# EAGLE schematic GPS_radiologger_LG77_CMWX_MAX v6 (EAGLE 9.7.0)
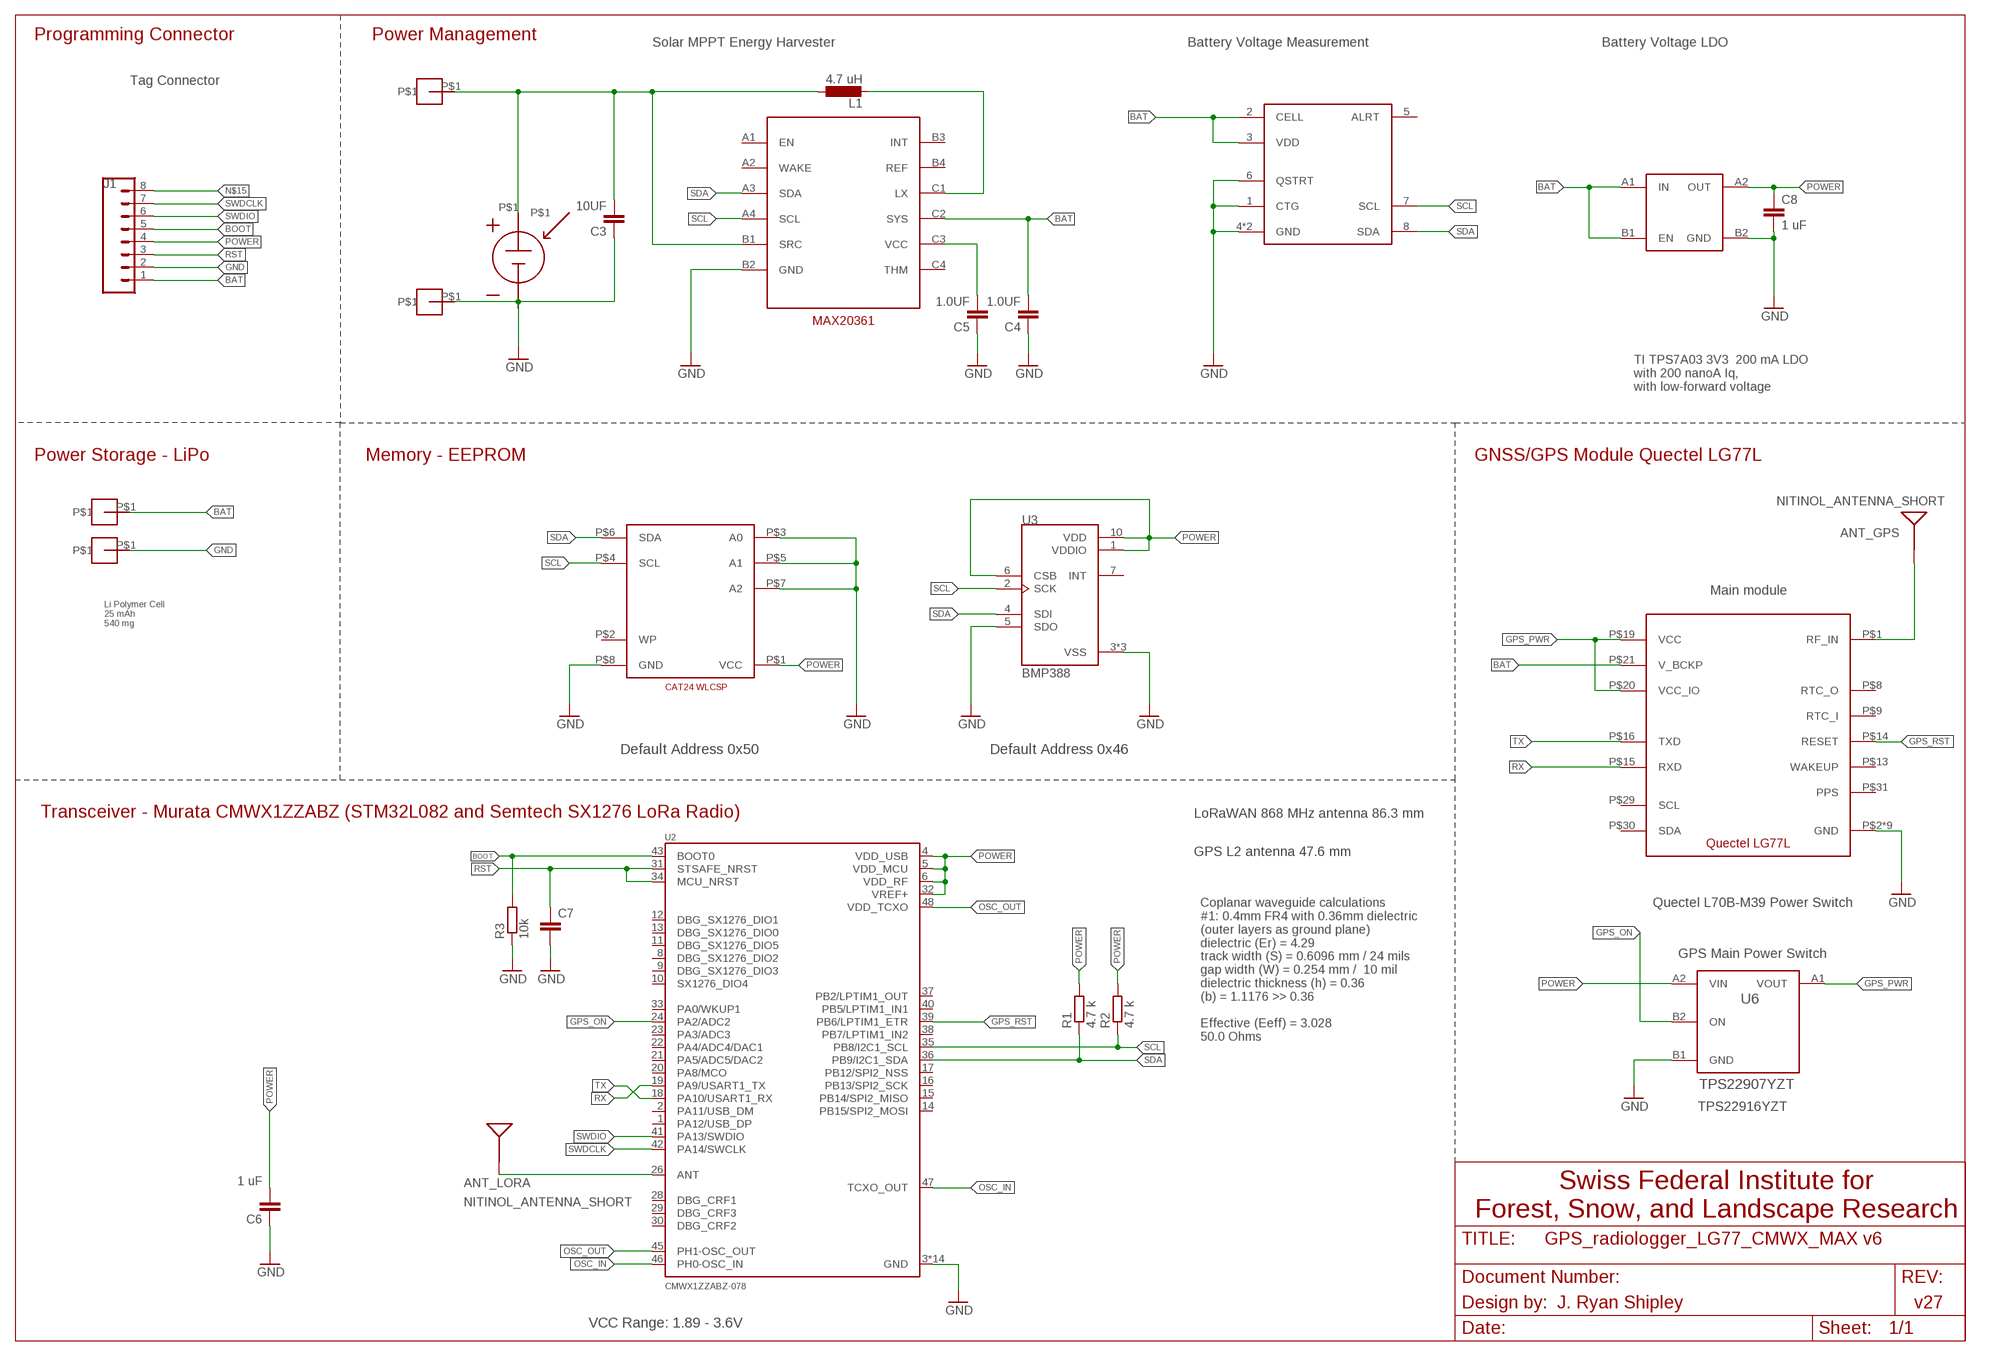
[diagram p0: schematic, sheet 1]

## Parts
ANT_GPS  NITINOL_ANTENNA_SHORT  [ICARUS_NITINOL_ANTENNA_SHORT]
ANT_LORA  NITINOL_ANTENNA_SHORT  [ICARUS_NITINOL_ANTENNA_SHORT]
C3  10UF  C-0402-SMALL  [C-0402-SMALL]
C4  1.0UF  C-0402-SMALL  [C-0402-SMALL]
C5  1.0UF  C-0402-SMALL  [C-0402-SMALL]
C6  1 uF  C-0402-SMALL  [C-0402-SMALL]
C7  C-EUC0201  [C0201]
C8  1 uF  C-0402-SMALL  [C-0402-SMALL]
J1  CONN_08NO_SILK_FEMALE_PTH  [1X08_NO_SILK]
L1  4.7 uH  IND_2016  [INDC2016X120L]
R1  4.7 k  R-EU_R0201  [R0201]
R2  4.7 k  R-EU_R0201  [R0201]
R3  10k  R-EU_R0201  [R0201]
U2  CMWX1ZZABZ-078  [XCVR_CMWX1ZZABZ-078]
U3  BMP388  [PQFN50P200X200X80-10N]
U4  TPS7A03-DSBGA  [BGA4N35P2X2_70X70X40N]
U5  MAX17048G+  [SON50P200X200X75-9T80X120L]
U6  TPS22907YZT  [YFP0004-DSBGA]
U7  CAT24_WLCSP8  [WLCSP8]
U8  MAX20361  [BGA12N40P4X3_123X163X64N]
U$1  LG77L  [LG77L]
U$2  BATT_CONNECT  [BATT_CONNECT]
U$3  BATT_CONNECT  [BATT_CONNECT]
U$4  BATT_CONNECT  [BATT_CONNECT]
U$5  TJC_BASIC  [TJC_POS_ONLY]
U$6  BATT_CONNECT  [BATT_CONNECT]

## Nets
BAT [battery]: C4.P$2 J1.1 U4.A1(IN) U4.B1(EN) U5.2(CELL) U5.3(VDD) U8.C2(SYS) U$1.P$21(V_BCKP) U$2.P$1
BOOT: J1.5 R3.2 U2.43(BOOT0)
GND: C3.P$1 C4.P$1 C5.P$1 C6.P$1 C7.2 C8.P$2 J1.2 R3.1 U2.3(GND) U2.7(GND) U2.25(GND) U2.27(GND) U2.44(GND) U2.49(GND) U2.50(GND) U2.51(GND) U2.52(GND) U2.53(GND) U2.54(GND) U2.55(GND) U2.56(GND) U2.57(GND) U3.3(VSS) U3.5(SDO) U3.8(VSS) U3.9(VSS) U4.B2(GND) U5.1(CTG) U5.4(GND) U5.6(QSTRT) U5.9(GND) U6.B1(GND) U7.P$3(A0) U7.P$5(A1) U7.P$7(A2) U7.P$8(GND) U8.B2(GND) U$1.P$2(GND) U$1.P$18(GND) U$1.P$37(GND) U$1.P$38(GND) U$1.P$39(GND) U$1.P$40(GND) U$1.P$41(GND) U$1.P$42(GND) U$1.P$43(GND) U$3.P$1 U$4.P$1
GPS_ON: U2.24(PA2/ADC2) U6.B2(ON)
GPS_PWR: U6.A1(VOUT) U$1.P$19(VCC) U$1.P$20(VCC_IO)
GPS_RST: U2.39(PB6/LPTIM1_ETR) U$1.P$14(RESET)
N$2 [antenna]: ANT_GPS.1(SIGNAL) ANT_GPS.2(SIGNAL) ANT_GPS.3(SIGNAL) U$1.P$1(RF_IN)
N$3: L1.2 U8.C1(LX)
N$4: C5.P$2 U8.C3(VCC)
N$11 [antenna]: ANT_LORA.1(SIGNAL) ANT_LORA.2(SIGNAL) ANT_LORA.3(SIGNAL) U2.26(ANT)
N$15 [battery]: C3.P$2 J1.8 L1.1 U8.B1(SRC) U$5.P$1 U$6.P$1
OSC_IN: U2.46(PH0-OSC_IN) U2.47(TCXO_OUT)
OSC_OUT: U2.45(PH1-OSC_OUT) U2.48(VDD_TCXO)
POWER [power]: C6.P$2 C8.P$1 J1.4 R1.2 R2.2 U2.4(VDD_USB) U2.5(VDD_MCU) U2.6(VDD_RF) U2.32(VREF+) U3.1(VDDIO) U3.6(CSB) U3.10(VDD) U4.A2(OUT) U6.A2(VIN) U7.P$1(VCC)
RST: C7.1 J1.3 U2.31(STSAFE_NRST) U2.34(MCU_NRST)
RX: U2.19(PA9/USART1_TX) U$1.P$15(RXD)
SCL: R2.1 U2.35(PB8/I2C1_SCL) U3.2(SCK) U5.7(SCL) U7.P$4(SCL) U8.A4(SCL)
SDA: R1.1 U2.36(PB9/I2C1_SDA) U3.4(SDI) U5.8(SDA) U7.P$6(SDA) U8.A3(SDA)
SWDCLK: J1.7 U2.42(PA14/SWCLK)
SWDIO: J1.6 U2.41(PA13/SWDIO)
TX: U2.18(PA10/USART1_RX) U$1.P$16(TXD)
Unconnected: U2.1(PA12/USB_DP) U2.2(PA11/USB_DM) U2.8(DBG_SX1276_DIO2) U2.9(DBG_SX1276_DIO3) U2.10(SX1276_DIO4) U2.11(DBG_SX1276_DIO5) U2.12(DBG_SX1276_DIO1) U2.13(DBG_SX1276_DIO0) U2.14(PB15/SPI2_MOSI) U2.15(PB14/SPI2_MISO) U2.16(PB13/SPI2_SCK) U2.17(PB12/SPI2_NSS) U2.20(PA8/MCO) U2.21(PA5/ADC5/DAC2) U2.22(PA4/ADC4/DAC1) U2.23(PA3/ADC3) U2.28(DBG_CRF1) U2.29(DBG_CRF3) U2.30(DBG_CRF2) U2.33(PA0/WKUP1) U2.37(PB2/LPTIM1_OUT) U2.38(PB7/LPTIM1_IN2) U2.40(PB5/LPTIM1_IN1) U3.7(INT) U5.5(ALRT) U7.P$2(WP) U8.A1(EN) U8.A2(WAKE) U8.B3(INT) U8.B4(REF) U8.C4(THM) U$1.P$8(RTC_O) U$1.P$9(RTC_I) U$1.P$13(WAKEUP) U$1.P$29(SCL) U$1.P$30(SDA) U$1.P$31(PPS)

## Notes on the sheet
- Programming Connector | Power Management
- Solar MPPT Energy Harvester | Battery Voltage Measurement | Battery Voltage LDO
- Tag Connector
- TI TPS7A03 3V3  200 mA LDO
  with 200 nanoA Iq, 
  with low-forward voltage
- Power Storage - LiPo | Memory - EEPROM | GNSS/GPS Module Quectel LG77L
- Main module
- Li Polymer Cell
  25 mAh
  540 mg
- Default Address 0x50 | Default Address 0x46
- Transceiver - Murata CMWX1ZZABZ (STM32L082 and Semtech SX1276 LoRa Radio) | LoRaWAN 868 MHz antenna 86.3 mm
- GPS L2 antenna 47.6 mm
- Quectel L70B-M39 Power Switch
- GPS Main Power Switch
- Coplanar waveguide calculations
  #1: 0.4mm FR4 with 0.36mm dielectric 
  (outer layers as ground plane)
  dielectric (Er) = 4.29
  track width (S) = 0.6096 mm / 24 mils
  gap width (W) = 0.254 mm /  10 mil
  dielectric thickness (h) = 0.36
  (b) = 1.1176 >> 0.36
  
  Effective (Eeff) = 3.028
  50.0 Ohms
- TPS22916YZT
- Swiss Federal Institute for
  Forest, Snow, and Landscape Research
- Design by: | J. Ryan Shipley | v27
- VCC Range: 1.89 - 3.6V

## Library data of the parts
ANT_GPS ANT_LORA = Antenna:NITINOL_ANTENNA_SHORT
C3-C6 C8 = Ryan_Custom_Fusion:C-0402-SMALL
C7 = rcl:C-EU: CAPACITOR, European symbol; SPICEPREFIX: C
J1 = SparkFun-Connectors:CONN_08: Multi connection point. Often used as Generic Header-pin footprint for 0.1 inch spaced/style header connections On any of the 0.1 inch spaced packages, you can populate with these: Break Away Headers - Straight <https://www.sparkfun.com/products/116> (PRT-00116) Break Away Male Headers - Right Angle <https://www.sparkfun.com/products/553> (PRT-00553) Female Headers <https://www.sparkfun.com/products/115> (PRT-00115) Break Away Headers - Machine Pin <https://www.sparkfun.com/products/117> (PRT-00117) Break Away Female Headers - Swiss Machine Pin <https://www.sparkfun.com/products/743> (PRT-00743) Arduino Stackable Header - 8 Pin <https://www.sparkfun.com/products/9279> (PRT-09279) For SCREWTERMINALS and SPRING TERMINALS visit here: Screw Terimnals on SparkFun.com <https://www.sparkfun.com/search/results?term=Screw+Terminals> (5mm/3.5mm/2.54mm spacing) This device is also useful as a general connection point to wire up your design to another part of your project. Our various solder wires solder well into these plated through hole pads. Hook-Up Wire - Assortment (Stranded, 22 AWG) <https://www.sparkfun.com/products/11375> (PRT-11375) Hook-Up Wire - Assortment (Solid Core, 22 AWG) <https://www.sparkfun.com/products/11367> (PRT-11367) View the entire wire category on our website here <https://www.sparkfun.com/categories/141> Special notes: Molex polarized connector foot print use with SKU : PRT-08231 with associated crimp pins and housings. 1MM SMD Version SKU: PRT-10208 NOTES ON THE VARIANTS LOCK and LOCK_LONGPADS... This footprint was designed to help hold the alignment of a through-hole component (i.e. 6-pin header) while soldering it into place. You may notice that each hole has been shifted either up or down by 0.005 of an inch from it's more standard position (which is a perfectly straight line). This slight alteration caused the pins (the squares in the middle) to touch the edges of the holes. Because they are alternating, it causes a "brace" to hold the component in place. 0.005 has proven to be the perfect amount of "off-center" position when using our standard breakaway headers. Although looks a little odd when you look at the bare footprint, once you have a header in there, the alteration is very hard to notice. Also,if you push a header all the way into place, it is covered up entirely on the bottom side.; PROD_ID: CONN-08438
L1 = Ryan_custom:IND_2016
R1-R3 = rcl:R-EU_: RESISTOR, European symbol; SPICEPREFIX: R
U2 = CMWX1ZZABZ-078:CMWX1ZZABZ-078: RF MODULE 860-930MHz 12.5x11.6x1.76mm 3.3Vdc Check availability <https://pricing.snapeda.com/parts/CMWX1ZZABZ-078/Murata/view-part?ref=eda>; AVAILABILITY: In Stock; DESCRIPTION: General ISM < 1GHz LoRa™ Transceiver Module 868MHz, 915MHz - Surface Mount; MF: Murata; MP: CMWX1ZZABZ-078; PACKAGE: Module Murata; PRICE: None; PURCHASE-URL: https://pricing.snapeda.com/search/part/CMWX1ZZABZ-078/?ref=eda
U3 = BMP388:BMP388: P-Sensor SPI I2C 1, 25 Bar SMD; AVAILABILITY: Unavailable; DESCRIPTION: Pressure Sensor 4.35PSI ~ 18.13PSI (30kPa ~ 125kPa) Absolute 10-WFLGA; MF: Bosch Sensortec; MP: BMP388; PACKAGE: WFLGA-10 Bosch Tools; PRICE: None
U4 = Ryan_Custom_Fusion:TPS7A03-DSBGA
U5 = Ryan_Custom_Fusion:MAX17048G+
U6 = TPS22916:TPS22907YZT
U7 = Ryan_Custom_Fusion:CAT24_WLCSP8
U8 = Ryan_Custom_Fusion:MAX20361
U$1 = Quectel:LG77L
U$2-U$4 U$6 = Ryan_Custom_Fusion:BATT_CONNECT
U$5 = Ryan_Custom_Fusion:TJC_BASIC

## Net classes
0 default: width 0.254 mm
1 power: width 0.305 mm
2 antenna: width 0.61 mm, clearance 0.305 mm
3 battery: width 0.254 mm
4 diff_pair: width 0.178 mm, clearance 0.152 mm